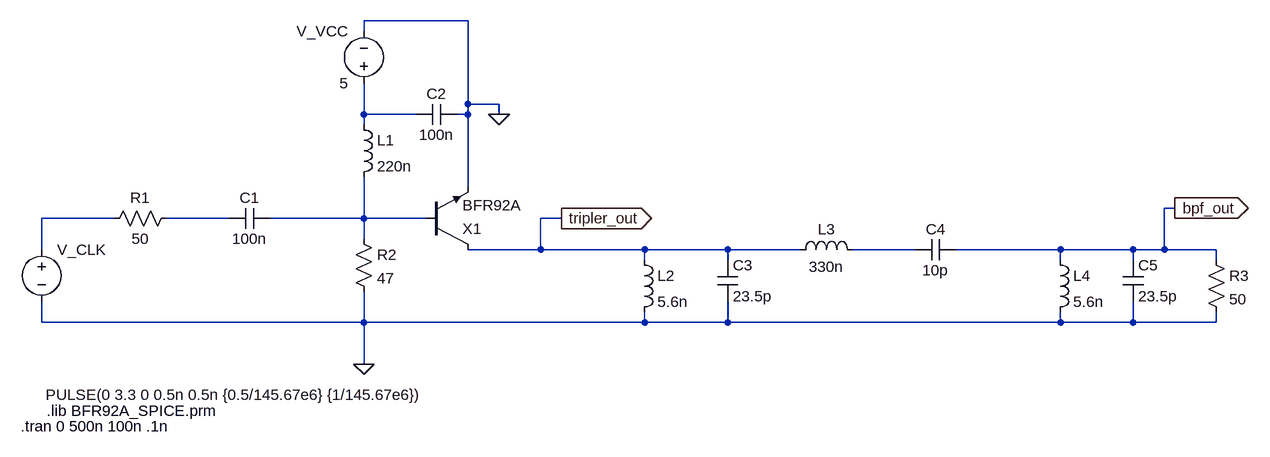
[diagram p0: schematic tripler_with_BPF.asc]
tripler_with_BPF.asc, the LTspice schematic file:
Version 4.1
SHEET 1 1688 680
WIRE 448 -96 288 -96
WIRE 288 -80 288 -96
WIRE 448 32 448 -96
WIRE 496 32 448 32
WIRE 288 48 288 0
WIRE 368 48 288 48
WIRE 448 48 448 32
WIRE 448 48 432 48
WIRE 496 48 496 32
WIRE 288 64 288 48
WIRE 448 160 448 48
WIRE 1536 192 1520 192
WIRE -96 208 -208 208
WIRE 80 208 -16 208
WIRE 288 208 288 144
WIRE 288 208 144 208
WIRE 384 208 288 208
WIRE 592 208 560 208
WIRE 288 240 288 208
WIRE -208 256 -208 208
WIRE 560 256 560 208
WIRE 560 256 448 256
WIRE 720 256 560 256
WIRE 848 256 720 256
WIRE 960 256 848 256
WIRE 1136 256 1040 256
WIRE 1360 256 1200 256
WIRE 1472 256 1360 256
WIRE 1520 256 1520 192
WIRE 1520 256 1472 256
WIRE 1600 256 1520 256
WIRE 720 272 720 256
WIRE 848 272 848 256
WIRE 1360 272 1360 256
WIRE 1472 272 1472 256
WIRE 1600 272 1600 256
WIRE -208 368 -208 336
WIRE 288 368 288 320
WIRE 288 368 -208 368
WIRE 720 368 720 352
WIRE 720 368 288 368
WIRE 848 368 848 336
WIRE 848 368 720 368
WIRE 1360 368 1360 352
WIRE 1360 368 848 368
WIRE 1472 368 1472 336
WIRE 1472 368 1360 368
WIRE 1600 368 1600 352
WIRE 1600 368 1472 368
WIRE 288 432 288 368
FLAG 496 48 0
FLAG 288 432 0
FLAG 592 208 tripler_out
IOPIN 592 208 Out
FLAG 1536 192 bpf_out
IOPIN 1536 192 Out
SYMBOL voltage -208 240 R0
WINDOW 3 6 239 Left 2
WINDOW 123 0 0 Left 0
WINDOW 39 0 0 Left 0
SYMATTR Value PULSE(0 3.3 0 0.5n 0.5n {0.5/145.67e6} {1/145.67e6})
SYMATTR InstName V_CLK
SYMBOL res 0 192 R90
WINDOW 0 0 56 VBottom 2
WINDOW 3 32 56 VTop 2
SYMATTR InstName R1
SYMATTR Value 50
SYMBOL cap 144 192 R90
WINDOW 0 0 32 VBottom 2
WINDOW 3 32 32 VTop 2
SYMATTR InstName C1
SYMATTR Value 100n
SYMBOL voltage 288 16 R180
WINDOW 0 24 96 Left 2
WINDOW 3 24 16 Left 2
WINDOW 123 0 0 Left 0
WINDOW 39 0 0 Left 0
SYMATTR InstName V_VCC
SYMATTR Value 5
SYMBOL ind 272 48 R0
SYMATTR InstName L1
SYMATTR Value 220n
SYMBOL res 272 224 R0
SYMATTR InstName R2
SYMATTR Value 47
SYMBOL cap 432 32 R90
WINDOW 0 0 32 VBottom 2
WINDOW 3 32 32 VTop 2
SYMATTR InstName C2
SYMATTR Value 100n
SYMBOL npn 384 256 M180
SYMATTR InstName X1
SYMATTR Value BFR92A
SYMATTR Prefix X
SYMBOL ind 704 256 R0
SYMATTR InstName L2
SYMATTR Value 5.6n
SYMBOL cap 832 272 R0
SYMATTR InstName C3
SYMATTR Value 23.5p
SYMBOL ind 944 272 R270
WINDOW 0 32 56 VTop 2
WINDOW 3 5 56 VBottom 2
SYMATTR InstName L3
SYMATTR Value 330n
SYMBOL cap 1200 240 R90
WINDOW 0 0 32 VBottom 2
WINDOW 3 32 32 VTop 2
SYMATTR InstName C4
SYMATTR Value 10p
SYMBOL ind 1344 256 R0
SYMATTR InstName L4
SYMATTR Value 5.6n
SYMBOL cap 1456 272 R0
SYMATTR InstName C5
SYMATTR Value 23.5p
SYMBOL res 1584 256 R0
SYMATTR InstName R3
SYMATTR Value 50
TEXT -200 504 Left 2 !.lib BFR92A_SPICE.prm
TEXT -240 528 Left 2 !.tran 0 500n 100n .1n

The netlist it stands for:
* tripler_with_BPF.asc
V_CLK N002 0 PULSE(0 3.3 0 0.5n 0.5n {0.5/145.67e6} {1/145.67e6})
R1 N003 N002 50
C1 N004 N003 100n
V_VCC N001 0 5
L1 N001 N004 220n
R2 N004 0 47
C2 0 N001 100n
X§X1 tripler_out N004 0 BFR92A  ; pins C B E
L2 tripler_out 0 5.6n
C3 tripler_out 0 23.5p
L3 tripler_out N005 330n
C4 bpf_out N005 10p
L4 bpf_out 0 5.6n
C5 bpf_out 0 23.5p
R3 bpf_out 0 50
.lib BFR92A_SPICE.prm
.tran 0 500n 100n .1n
.backanno
.end